# Altium schematic sheet no_erc.SchDoc
size A4
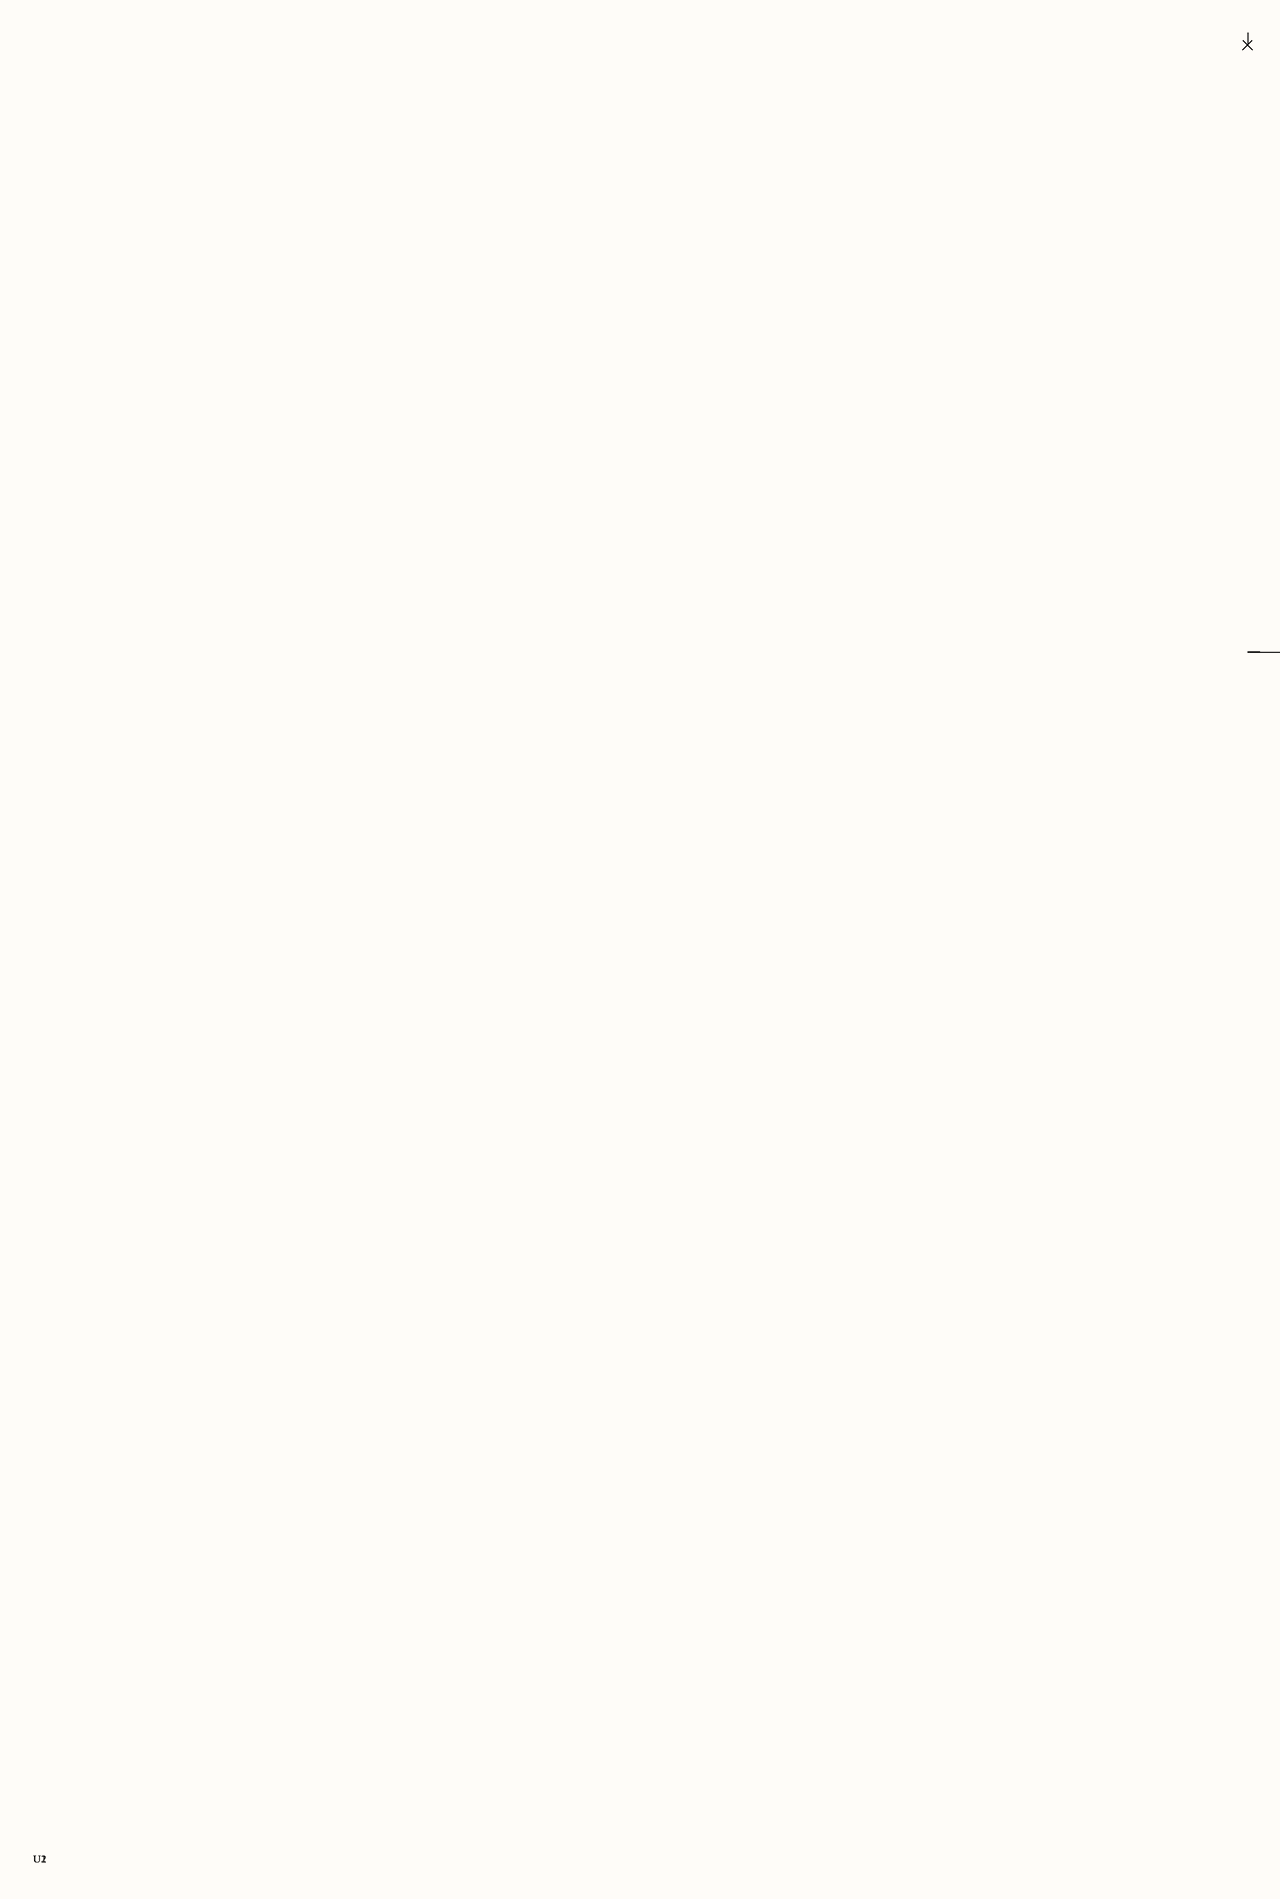
[diagram p0: no_erc.SchDoc, left]
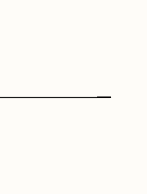
[diagram p1: no_erc.SchDoc, right]

## Parts
U1  (no value)
U2  (no value)

## Nets
NetU1_1: U1.1(A) U2.1(B)

Not connected (* = marked no-connect by the designer): U1 2(NC)*

## Library data of the parts
U1 U2 = DEVICE